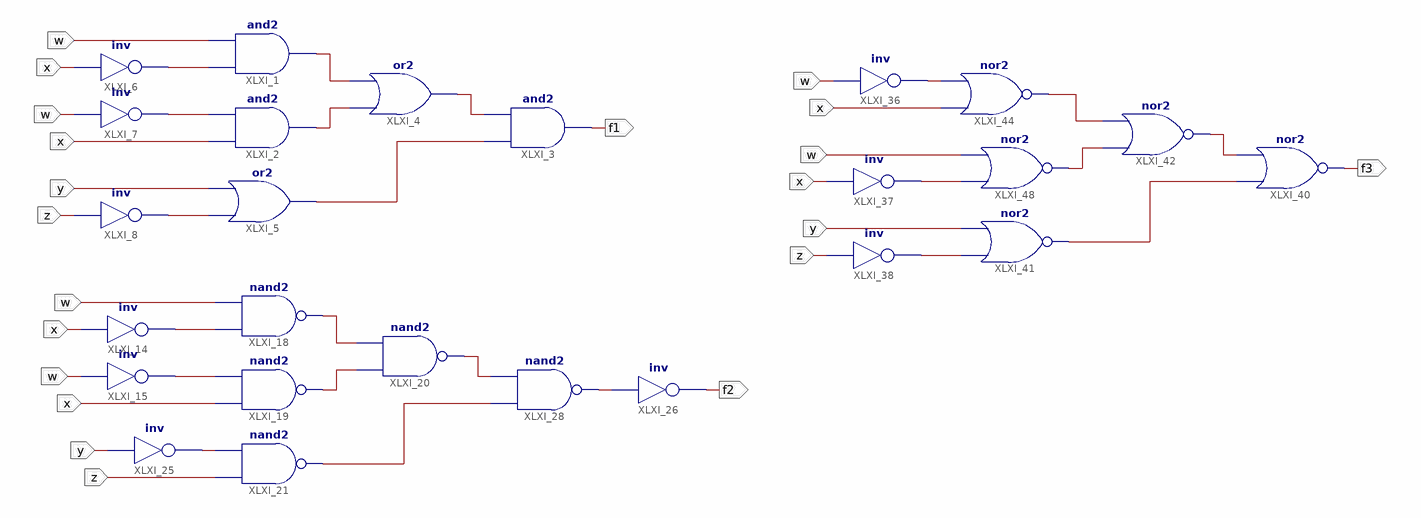
[diagram p0: schematic sheet 1]
// Xilinx ISE schematic scha.sch (artix7) as structural Verilog: 25 symbols, 7 ports
module scha (
  input  w,
  input  y,
  input  x,
  input  z,
  output f1,
  output f2,
  output f3
);

  wire XLXN_2, XLXN_3, XLXN_6, XLXN_10, XLXN_11, XLXN_12, XLXN_13, XLXN_16, XLXN_17, XLXN_24, XLXN_25,
       XLXN_26, XLXN_27, XLXN_42, XLXN_53, XLXN_56, XLXN_57, XLXN_60, XLXN_65, XLXN_66, XLXN_67, XLXN_87;

  and XLXI_1 (XLXN_10, XLXN_2, w);
  and XLXI_2 (XLXN_11, x, XLXN_3);
  and XLXI_3 (f1, XLXN_13, XLXN_12);
  or XLXI_4 (XLXN_12, XLXN_11, XLXN_10);
  or XLXI_5 (XLXN_13, XLXN_6, y);
  not XLXI_6 (XLXN_2, x);
  not XLXI_7 (XLXN_3, w);
  not XLXI_8 (XLXN_6, z);
  not XLXI_14 (XLXN_16, x);
  not XLXI_15 (XLXN_17, w);
  nand XLXI_18 (XLXN_24, XLXN_16, w);
  nand XLXI_19 (XLXN_25, x, XLXN_17);
  nand XLXI_20 (XLXN_26, XLXN_25, XLXN_24);
  nand XLXI_21 (XLXN_27, z, XLXN_42);
  not XLXI_25 (XLXN_42, y);
  nand XLXI_28 (XLXN_53, XLXN_27, XLXN_26);
  not XLXI_26 (f2, XLXN_53);
  not XLXI_38 (XLXN_60, z);
  nor XLXI_40 (f3, XLXN_67, XLXN_66);
  nor XLXI_41 (XLXN_67, XLXN_60, y);
  nor XLXI_42 (XLXN_66, XLXN_65, XLXN_87);
  nor XLXI_44 (XLXN_87, x, XLXN_56);
  not XLXI_36 (XLXN_56, w);
  nor XLXI_48 (XLXN_65, XLXN_57, w);
  not XLXI_37 (XLXN_57, x);
endmodule
